# Altium schematic sheet neural_reactor.SchDoc
size A3; SheetNumber: 1; SheetTotal: 1
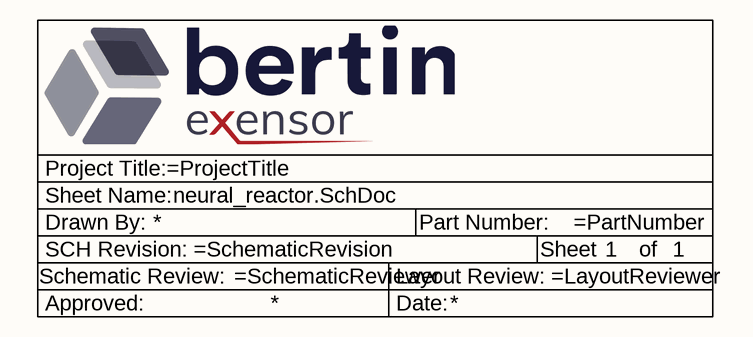
[diagram p0: neural_reactor.SchDoc]

## Parts
TB?  Title Block  (value not drawn)  (graphical)

## Notes on the sheet
- (in symbol Title Block) Project Title:; Sheet Name:; Drawn By:; Part Number:; SCH Revision:; Sheet; of; Schematic Review:; Layout Review:; Approved:; Date: